# EAGLE design radio_v2 (EAGLE 6.5.0)
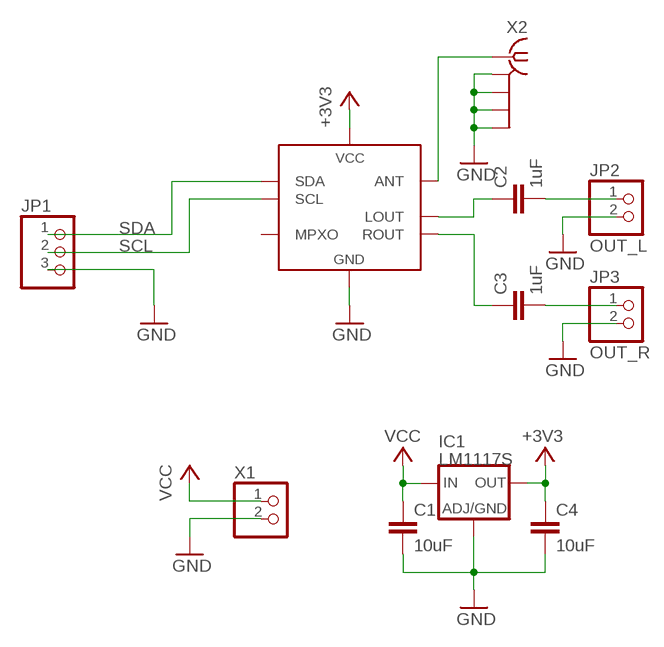
[diagram p0: schematic, sheet 1]

## Parts
C1  10uF  C-EUC0805K  [C0805K]
C2  1uF  C-EUC0805K  [C0805K]
C3  1uF  C-EUC0805K  [C0805K]
C4  10uF  C-EUC0805K  [C0805K]
IC1  LM1117S  [SOT223]
JP1  PINHD-1X3180  [1X03]
JP2  OUT_L  PINHD-1X2  [1X02]
JP3  OUT_R  PINHD-1X2  [1X02]
U1  TEA5767  [TEA5767]
X1  22-23-2021  [22-23-2021]
X2  BU-SMA-V  [BU-SMA-V]

## Nets
+3V3: C4.1 IC1.2(OUT) IC1.4(OUT) U1.5(VCC)
GND: C1.2 C4.2 IC1.1(ADJ) JP1.3 JP2.2 JP3.2 U1.3(GND) U1.6(GND) X1.2 X2.2(GND1) X2.3(GND2) X2.4(GND3) X2.5(GND4)
N$1: U1.10(ANT) X2.1
N$2: C3.1 U1.7(ROUT)
N$3: C3.2 JP3.1
N$4: C2.2 JP2.1
OUT_R: C2.1 U1.8(LOUT)
SCL: JP1.2 U1.2(SCL)
SDA: JP1.1 U1.1(SDA)
VCC: C1.1 IC1.3(IN) X1.1
Unconnected: U1.9(MPXO)

## Library data of the parts
C1-C4 = amp:C-EU: CAPACITOR, European symbol
IC1 = amp:LM1117: Low drop fixed and adjustable positive voltage regulators 1 A Source: http://www.st.com/stonline/products/literature/ds/7194/ld1117axx.pdf
JP1 = amp:PINHD-1X3: PIN HEADER
JP2 JP3 = amp:PINHD-1X2: PIN HEADER
U1 = amp:TEA5767
X1 = amp:22-23-2021: .100" (2.54mm) Center Header - 2 Pin
X2 = amp:BU-SMA-V: FEMALE SMA CONNECTOR Radiall distributor RS 112-3794; OC_FARNELL: unknown; OC_NEWARK: unknown

## Board
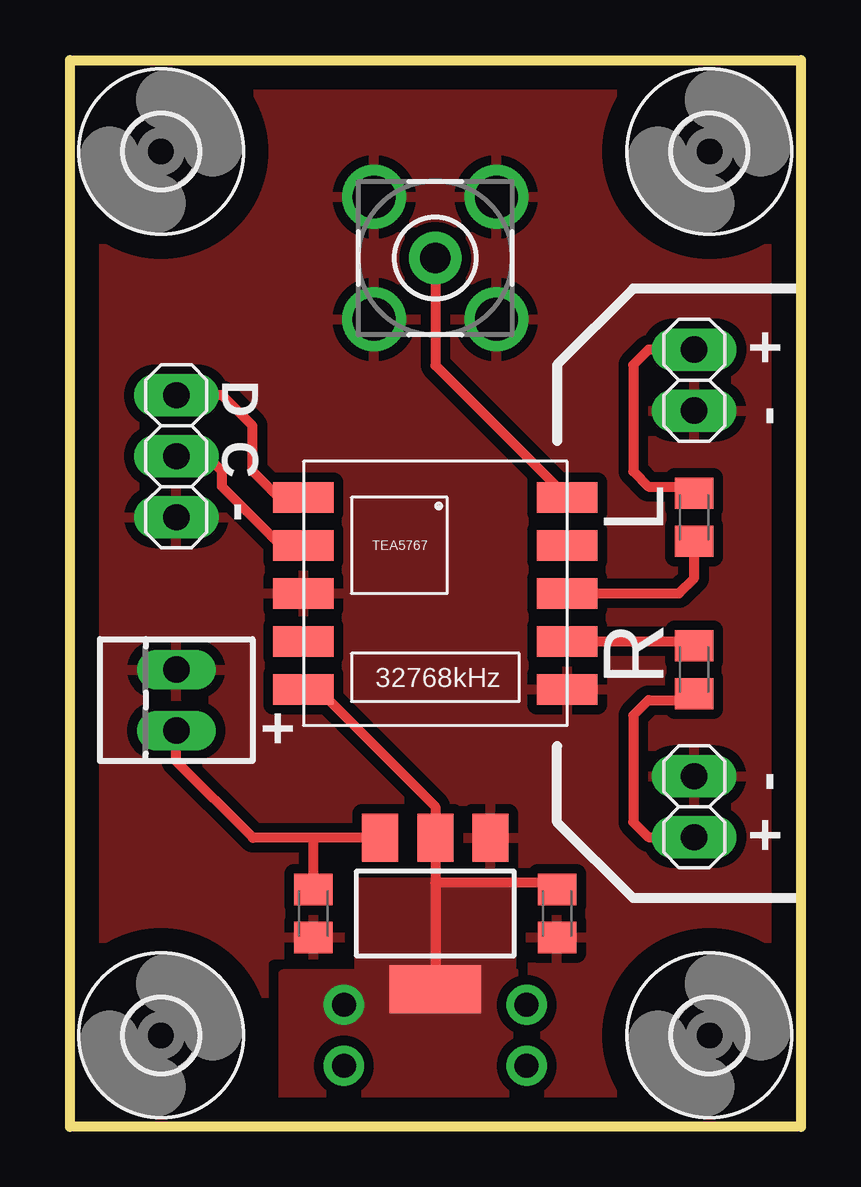
[diagram p1: board, top side]
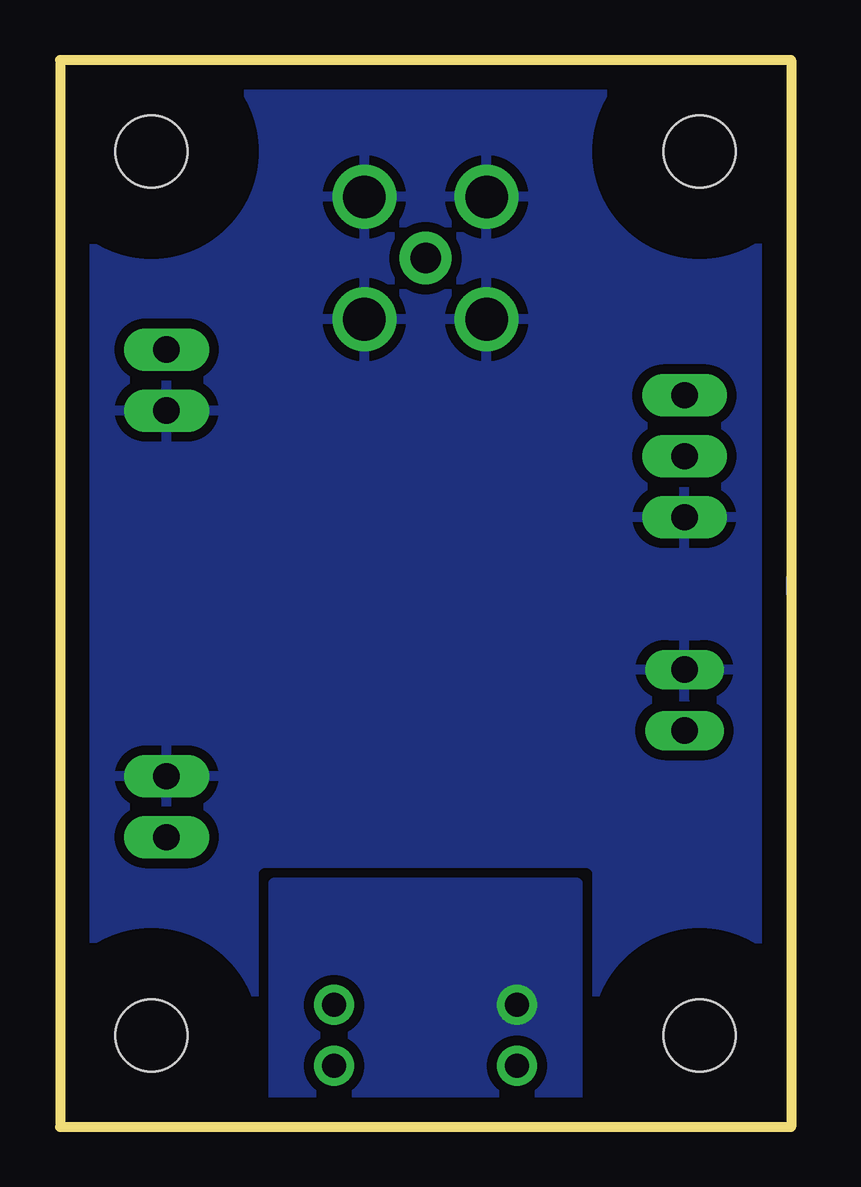
[diagram p2: board, bottom side, seen from below]

Size 30.48 x 44.45 mm. Coordinates in mm from the lower left corner, seen from the top.
Outline: 0.64,44.44 0,44.45
Outline: 0,44.45 0,0 30.48,0 30.48,44.45 0,44.45
Copper layers (1*16): Top 0.035mm / dielectric 1.5mm / Bottom 0.035mm
Design rules "default": minimum track width 10mil, minimum drill 24mil, track to track 8mil, track to pad 8mil, pad to pad 8mil, via to via 8mil, smd to smd 8mil, copper to edge 40mil, drill to drill 8mil, minimum pad ring 10mil, minimum via ring 8mil, stop-mask expansion 4mil, vias tented up to drill 0mil, thermal gap 16mil

### Footprints (pad centres in the part's own frame; a part is rotated, then mirrored left to right if it is on the bottom)
C0805K = smd 1.3 x 1.6: 1 -1,0; 2 1,0
SOT223 = smd 1.5 x 2: 1 -2.3,-3.15; 2 0,-3.15; 3 2.3,-3.15 | smd 3.8 x 2: 4 0,3.15
1X03 = drill 1.1 pad 1.778 long: 1 -2.54,0; 2 0,0; 3 2.54,0
1X02 = drill 1.1 pad 1.778 long: 1 -1.27,0; 2 1.27,0
TEA5767 = smd 2.54 x 1.27: 1 -5.5,4; 2 -5.5,2; 3 -5.5,0; 4 -5.5,-2; 5 -5.5,-4; 6 5.5,-4; 7 5.5,-2; 8 5.5,0; 9 5.5,2; 10 5.5,4
3,0 = hole 3: 0,0
22-23-2021 = drill 1.1 long: 1 -1.27,0; 2 1.27,0
BU-SMA-V = drill 1.27 pad 2.184: 1 0,0 | drill 1.778: 2 -2.55,2.55; 3 2.55,2.55; 4 2.55,-2.55; 5 -2.55,-2.55

### Placement (x,y rotation side)
C1  10.16,8.89 270 top
C2  26.04,25.4 90 top
C3  26.04,19.05 270 top
C4  20.32,8.89 270 top
IC1  15.24,8.89 180 top
JP1  4.45,27.94 270 top
JP2  26.04,31.11 270 top
JP3  26.04,13.34 90 top
U1  15.24,22.23 0 top
U$1  [3,0]  3.81,3.81 0 top
U$2  [3,0]  3.81,40.64 0 top
U$3  [3,0]  26.67,40.64 0 top
U$4  [3,0]  26.67,3.81 0 top
X1  4.45,17.78 90 top
X2  15.24,36.2 90 top

### Tracks (layer width: path | path; a pad name or v marks a point on that pad's centre or on a via)
+3V3  (via drill 1 pad 1.68)
  Top 0.406: 15.24,10.16 IC1.2 15.24,13.34 10.35,18.23 U1.5 | 15.24,10.16 IC1.4 | C4.1 20.32,10.16 15.24,10.16
  other vias: 11.43,5.08
  pour Bottom (isolate 0.406, no thermals): 8.89,0 8.89,10.16 21.59,10.16 21.59,0
  pour Top (isolate 0.406, no thermals): 18.41,10.16 12.06,10.16 12.06,6.35 8.89,6.35 8.89,0 21.59,0 21.59,6.35 18.41,6.35
GND
  pour Bottom (isolate 0.406, rank 2): -1.27,45.72 -1.27,-1.27 31.75,-1.27 31.75,45.72
  pour Top (isolate 0.406, rank 2): -1.27,45.72 -1.27,-1.27 31.75,-1.27 31.75,45.72
N$1
  Top 0.406: X2.1 15.24,31.73 U1.10
N$2
  Top 0.406: U1.7 26.04,20.23 C3.1
N$3
  Top 0.406: JP3.1 24.13,12.06 23.5,12.7 23.5,17.14 24.13,17.78 25.77,17.78 C3.2
N$4
  Top 0.406: JP2.1 24.13,32.38 23.5,31.75 23.5,27.3 24.13,26.67 25.77,26.67 C2.2
N$5  (via drill 1 pad 1.68)
  other vias: 11.43,2.54
N$6  (via drill 1 pad 1.68)
  other vias: 19.05,2.54
N$7  (via drill 1 pad 1.68)
  other vias: 19.05,5.08
N$35
  Bottom 0.406: 0,22.23 0,22.86
OUT_R
  Top 0.406: U1.8 25.4,22.23 26.04,22.86 C2.1
SCL
  Top 0.406: U1.2 8.79,24.23 6.35,26.67 6.35,27.3 5.71,27.94 JP1.2
SDA
  Top 0.406: U1.1 8.7,26.23 7.62,27.3 7.62,29.21 6.35,30.48 JP1.1
VCC
  Top 0.406: IC1.3 10.16,12.04 | 10.16,12.04 7.64,12.04 4.45,15.24 X1.1 | C1.1 10.16,12.04

### Text on the board
tNames: + | D | C | - | - | L | R | + | - | +